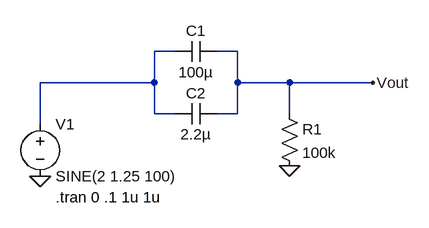
[diagram p0: schematic Vin_2_5_Vpp_100Hz_VinRef_2V_VoutRef_0V.asc]
Vin_2_5_Vpp_100Hz_VinRef_2V_VoutRef_0V.asc, the LTspice schematic file:
Version 4.1
SHEET 1 880 680
WIRE 256 0 224 0
WIRE 352 0 320 0
WIRE 224 48 224 0
WIRE 224 48 48 48
WIRE 352 48 352 0
WIRE 432 48 352 48
WIRE 560 48 432 48
WIRE 224 96 224 48
WIRE 256 96 224 96
WIRE 352 96 352 48
WIRE 352 96 320 96
WIRE 432 96 432 48
WIRE 48 112 48 48
FLAG 48 192 0
FLAG 432 176 0
FLAG 560 48 Vout
SYMBOL voltage 48 96 R0
WINDOW 123 0 0 Left 0
WINDOW 39 0 0 Left 0
SYMATTR InstName V1
SYMATTR Value SINE(2 1.25 100)
SYMBOL cap 320 -16 R90
WINDOW 0 0 32 VBottom 2
WINDOW 3 32 32 VTop 2
SYMATTR InstName C1
SYMATTR Value 100µ
SYMBOL cap 320 80 R90
WINDOW 0 0 32 VBottom 2
WINDOW 3 32 32 VTop 2
SYMATTR InstName C2
SYMATTR Value 2.2µ
SYMBOL res 416 80 R0
SYMATTR InstName R1
SYMATTR Value 100k
TEXT 72 224 Left 2 !.tran 0 .1 1u 1u

The netlist it stands for:
* Vin_2_5_Vpp_100Hz_VinRef_2V_VoutRef_0V.asc
V1 N001 0 SINE(2 1.25 100)
C1 Vout N001 100µ
C2 Vout N001 2.2µ
R1 Vout 0 100k
.tran 0 .1 1u 1u
.backanno
.end